# EAGLE schematic SPI_HD44780 (EAGLE 7.2.0)
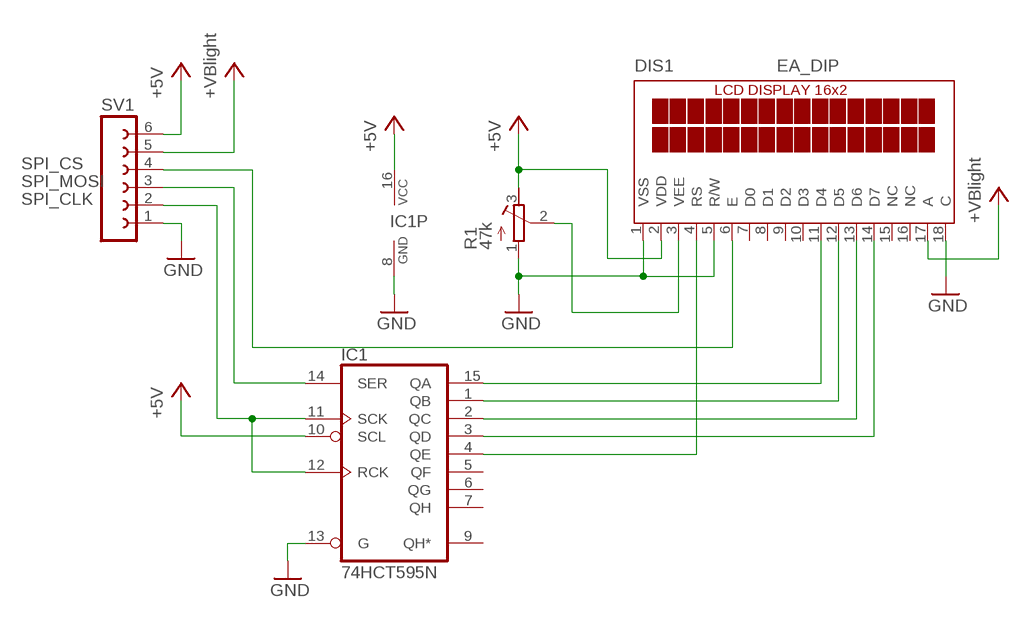
[diagram p0: schematic, sheet 1]

## Parts
DIS1  EA_DIP  [EA_DIP]
IC1  74HCT595N  [DIL16]
R1  47k  R-TRIMM3339P  [RTRIM3339P]
SV1  FE06-1  [FE06]

## Nets
+3V3: DIS1.17(A) SV1.5 ; supply symbol labelled +VBlight
+5V: DIS1.2(VDD) IC1.10(SCL) IC1.16(VCC) R1.3(E) SV1.6
GND: DIS1.1(VSS) DIS1.5(R/W) DIS1.18(C) IC1.8(GND) IC1.13(G) R1.1(A) SV1.1
N$1: DIS1.11(D4) IC1.15(QA)
N$2: DIS1.12(D5) IC1.1(QB)
N$3: DIS1.13(D6) IC1.2(QC)
N$4: DIS1.14(D7) IC1.3(QD)
N$5: DIS1.4(RS) IC1.4(QE)
N$8: DIS1.3(VEE) R1.2(S)
SPI_CLK: IC1.11(SCK) IC1.12(RCK) SV1.2
SPI_CS: DIS1.6(E) SV1.4
SPI_MOSI: IC1.14(SER) SV1.3
Unconnected: DIS1.7(D0) DIS1.8(D1) DIS1.9(D2) DIS1.10(D3) DIS1.15(NC) DIS1.16(NC) IC1.5(QF) IC1.6(QG) IC1.7(QH) IC1.9(QH*)

## Library data of the parts
DIS1 = display-lcd:EA_DIP: LCD-MODUL 2x16 - 6,68mm, INKL. KONTROLLER HD44780 Source: Data sheet <http://www.lcd-module.de/pdf/doma/dip162-d.pdf>
IC1 = 74xx-eu:74*595: 8-bit SHIFT REGISTER, output latch
R1 = rcl:R-TRIMM: Trimm resistor
SV1 = con-lsta:FE06-1: FEMALE HEADER; OC_FARNELL: unknown; OC_NEWARK: unknown